# EAGLE design M3 (EAGLE 6.2)
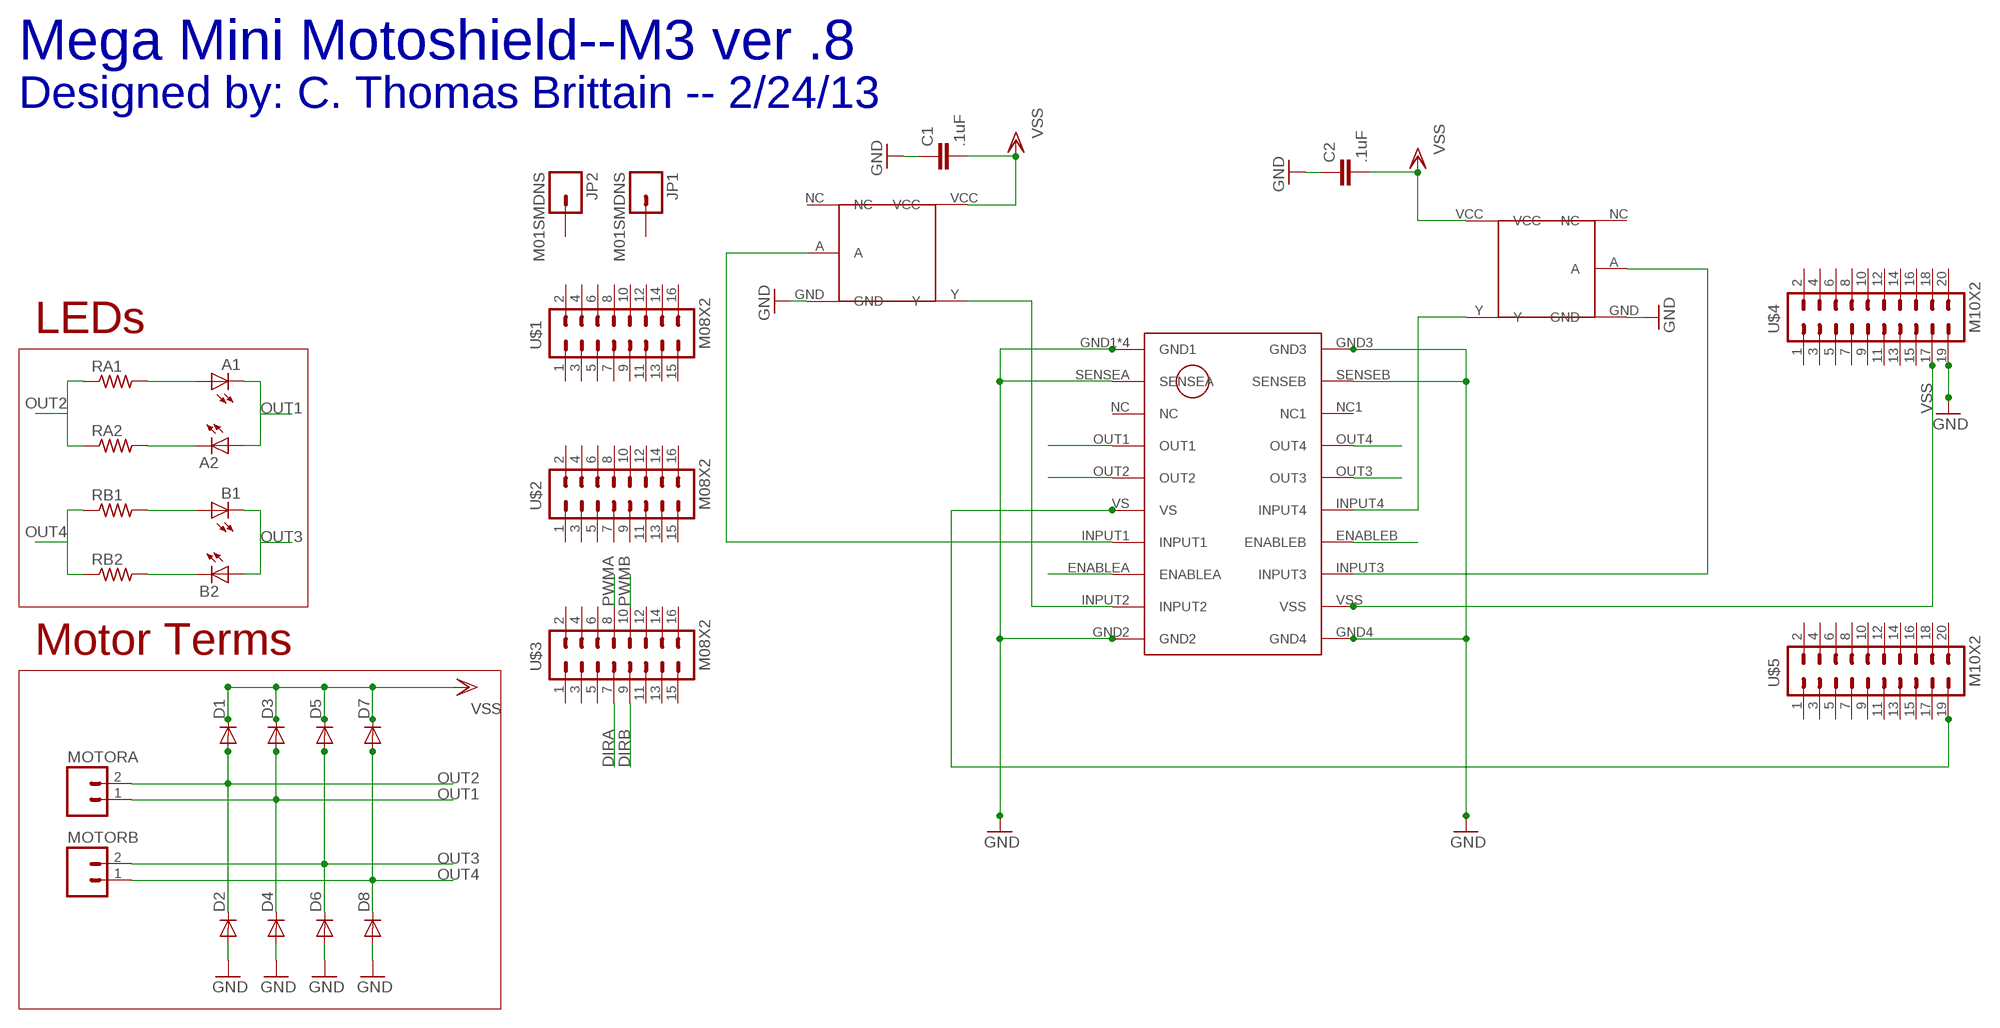
[diagram p0: schematic, sheet 1]

## Parts
A1  LEDSML0603  [SML0603]
A2  LEDSML0603  [SML0603]
B1  LEDSML0603  [SML0603]
B2  LEDSML0603  [SML0603]
C1  .1uF  C-EUC0805  [C0805]
C2  .1uF  C-EUC0805  [C0805]
D1  DIODESMA  [SMA-DIODE]
D2  DIODESMA  [SMA-DIODE]
D3  DIODESMA  [SMA-DIODE]
D4  DIODESMA  [SMA-DIODE]
D5  DIODESMA  [SMA-DIODE]
D6  DIODESMA  [SMA-DIODE]
D7  DIODESMA  [SMA-DIODE]
D8  DIODESMA  [SMA-DIODE]
JP1  M01SMDNS  [1X01NS]
JP2  M01SMDNS  [1X01NS]
MOTORA  M023.5MM  [SCREWTERMINAL-3.5MM-2]
MOTORB  M023.5MM  [SCREWTERMINAL-3.5MM-2]
RA1  R-US_R0805  [R0805]
RA2  R-US_R0805  [R0805]
RB1  R-US_R0805  [R0805]
RB2  R-US_R0805  [R0805]
U$1  M08X2  [2X8]
U$2  M08X2  [2X8]
U$3  M08X2  [2X8]
U$4  M10X2  [2X10]
U$5  M10X2  [2X10]
U$6  L298P  [SMARTPRJ_POWER-SO20]
U$7  74HC1G04  [SPARKFUN_SC70]
U$8  74HC1G04  [SPARKFUN_SC70]

## Nets
DIRA: U$3.7 U$6.INPUT1 U$7.A
DIRB: U$3.9 U$6.INPUT3 U$8.A
GND: C1.1 C2.1 D2.A D4.A D6.A D8.A U$4.19 U$6.GND1 U$6.GND2 U$6.GND3 U$6.GND4 U$6.GND5(GND1) U$6.GND6(GND1) U$6.GND7(GND1) U$6.SENSEA U$6.SENSEB U$7.GND U$8.GND
N$1: A2.C RA2.2
N$2: U$5.19 U$6.VS
N$3: U$6.INPUT2 U$7.Y
N$4: U$6.INPUT4 U$8.Y
N$5: A1.A RA1.2
N$8: B1.A RB1.2
N$11: B2.C RB2.2
OUT1: A1.C A2.A D3.A D4.C MOTORA.1 U$6.OUT1
OUT2: D1.A D2.C MOTORA.2 RA1.1 RA2.1 U$6.OUT2
OUT3: B1.C B2.A D5.A D6.C MOTORB.2 U$6.OUT4
OUT4: D7.A D8.C MOTORB.1 RB1.1 RB2.1 U$6.OUT3
PWMA: U$3.8 U$6.ENABLEA
PWMB: U$3.10 U$6.ENABLEB
VSS: C1.2 C2.2 D1.C D3.C D5.C D7.C U$4.17 U$6.VSS U$7.VCC U$8.VCC
Unconnected: JP1.1 JP2.1 U$1.1 U$1.2 U$1.3 U$1.4 U$1.5 U$1.6 U$1.7 U$1.8 U$1.9 U$1.10 U$1.11 U$1.12 U$1.13 U$1.14 U$1.15 U$1.16 U$2.1 U$2.2 U$2.3 U$2.4 U$2.5 U$2.6 U$2.7 U$2.8 U$2.9 U$2.10 U$2.11 U$2.12 U$2.13 U$2.14 U$2.15 U$2.16 U$3.1 U$3.2 U$3.3 U$3.4 U$3.5 U$3.6 U$3.11 U$3.12 U$3.13 U$3.14 U$3.15 U$3.16 U$4.1 U$4.2 U$4.3 U$4.4 U$4.5 U$4.6 U$4.7 U$4.8 U$4.9 U$4.10 U$4.11 U$4.12 U$4.13 U$4.14 U$4.15 U$4.16 U$4.18 U$4.20 U$5.1 U$5.2 U$5.3 U$5.4 U$5.5 U$5.6 U$5.7 U$5.8 U$5.9 U$5.10 U$5.11 U$5.12 U$5.13 U$5.14 U$5.15 U$5.16 U$5.17 U$5.18 U$5.20 U$6.NC U$6.NC1 U$7.NC U$8.NC

## Notes on the sheet
- Mega Mini Motoshield--M3 ver .8
- Designed by: C. Thomas Brittain -- 2/24/13
- LEDs
- Motor Terms

## Library data of the parts
A1 A2 B1 B2 = led:LED: LED OSRAM: - CHIPLED LG R971, LG N971, LY N971, LG Q971, LY Q971, LO R971, LY R971 LH N974, LH R974 LS Q976, LO Q976, LY Q976 LO Q996 - Hyper CHIPLED LW Q18S LB Q993, LB Q99A, LB R99A - SideLED LS A670, LO A670, LY A670, LG A670, LP A670 LB A673, LV A673, LT A673, LW A673 LH A674 LY A675 LS A676, LA A676, LO A676, LY A676, LW A676 LS A679, LY A679, LG A679 - Hyper Micro SIDELED® LS Y876, LA Y876, LO Y876, LY Y876 LT Y87S - SmartLED LW L88C, LW L88S LB L89C, LB L89S, LG L890 LS L89K, LO L89K, LY L89K LS L896, LA L896, LO L896, LY L896 - TOPLED LS T670, LO T670, LY T670, LG T670, LP T670 LSG T670, LSP T670, LSY T670, LOP T670, LYG T670 LG T671, LOG T671, LSG T671 LB T673, LV T673, LT T673, LW T673 LH T674 LS T676, LA T676, LO T676, LY T676, LB T676, LH T676, LSB T676, LW T676 LB T67C, LV T67C, LT T67C, LS T67K, LO T67K, LY T67K, LW E67C LS E67B, LA E67B, LO E67B, LY E67B, LB E67C, LV E67C, LT E67C LW T67C LS T679, LY T679, LG T679 LS T770, LO T770, LY T770, LG T770, LP T770 LB T773, LV T773, LT T773, LW T773 LH T774 LS E675, LA E675, LY E675, LS T675 LS T776, LA T776, LO T776, LY T776, LB T776 LHGB T686 LT T68C, LB T68C - Hyper Mini TOPLED® LB M676 - Mini TOPLED Santana® LG M470 LS M47K, LO M47K, LY M47K Source: http://www.osram.convergy.de LUXEON: - LUMILED® LXK2-PW12-R00, LXK2-PW12-S00, LXK2-PW14-U00, LXK2-PW14-V00 LXK2-PM12-R00, LXK2-PM12-S00, LXK2-PM14-U00 LXK2-PE12-Q00, LXK2-PE12-R00, LXK2-PE12-S00, LXK2-PE14-T00, LXK2-PE14-U00 LXK2-PB12-K00, LXK2-PB12-L00, LXK2-PB12-M00, LXK2-PB14-N00, LXK2-PB14-P00, LXK2-PB14-Q00 LXK2-PR12-L00, LXK2-PR12-M00, LXK2-PR14-Q00, LXK2-PR14-R00 LXK2-PD12-Q00, LXK2-PD12-R00, LXK2-PD12-S00 LXK2-PH12-R00, LXK2-PH12-S00 LXK2-PL12-P00, LXK2-PL12-Q00, LXK2-PL12-R00 Source: www.luxeon.com KINGBRIGHT: KA-3528ASYC Source: www.kingbright.com
C1 C2 = resistor:C-EU: CAPACITOR, European symbol
D1-D8 = SparkFun:DIODE: Diode These are standard reverse protection diodes and small signal diodes. SMA package can handle up to about 1A. SOD-323 can handle about 200mA. What the SOD-323 package when ordering, there are some mfgs out there that are 5-pin packages.
JP1 JP2 = SparkFun:M01: Header 1 Standard 1-pin 0.1" header. Use with straight break away headers (SKU : PRT-00116), right angle break away headers (PRT-00553), swiss pins (PRT-00743), machine pins (PRT-00117), and female headers (PRT-00115).
MOTORA MOTORB = SparkFun:M02: Header 2 Standard 2-pin 0.1" header. Use with straight break away headers (SKU : PRT-00116), right angle break away headers (PRT-00553), swiss pins (PRT-00743), machine pins (PRT-00117), and female headers (PRT-00115). Molex polarized connector foot print use with SKU : PRT-08233 with associated crimp pins and housings.
RA1 RA2 RB1 RB2 = resistor:R-US_: RESISTOR, American symbol
U$1-U$3 = SparkFun:M08X2
U$4 U$5 = SparkFun:M10X2: This was SPECIALLY designed to be used with our Graphic LCD Backpack. Be sure you want to use this! It is not only staggered on each line of header holes, but IT IS ALSO offset of the center point of the top and bottom lines by 5 mil. This causes the headers to lock into place on the "standard" footprint on the LCD screen. The extra squares on the tdocu layer are there simply to reference other pins (if you were to actually populate a longer header than ten long - this is what we do with the backpacks).
U$6 = Shield_Motor-REV3c:L298P
U$7 U$8 = Ardumoto_v13:74HC1G04

## Board
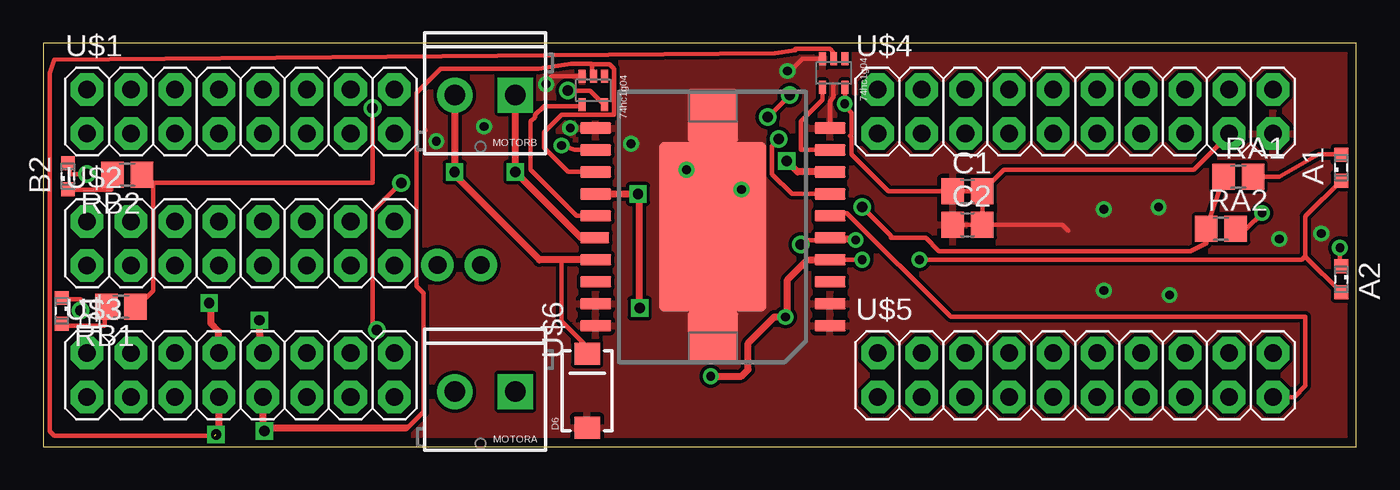
[diagram p1: board, top side]
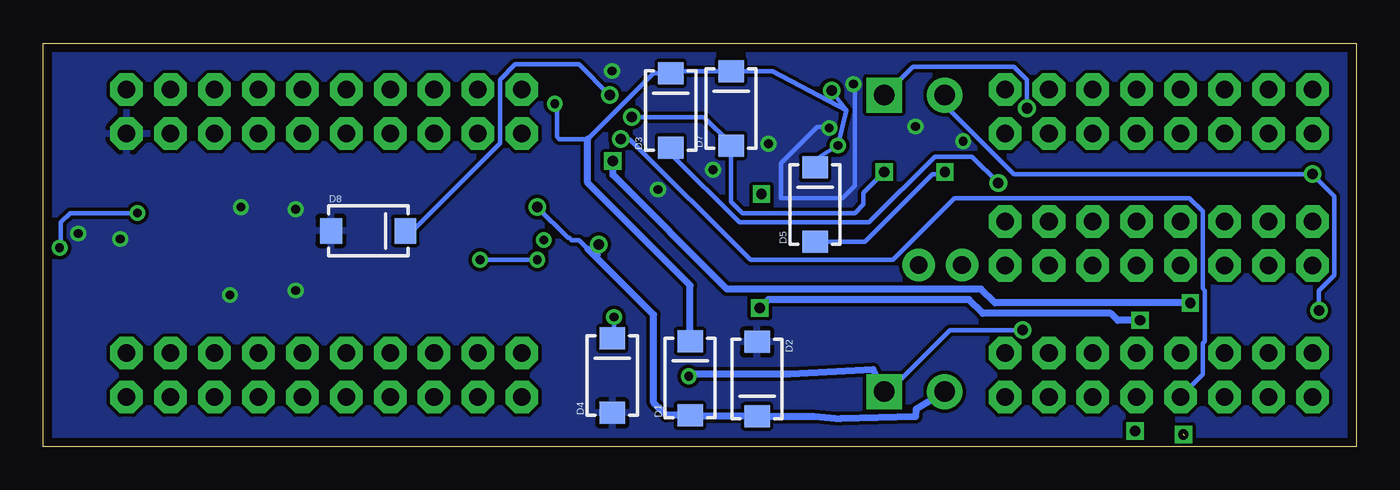
[diagram p2: board, bottom side, seen from below]

Size 75.95 x 23.32 mm. Coordinates in mm from the lower left corner, seen from the top.
Outline: 0,0 75.95,0 75.95,23.32 0,23.32 0,0
Copper layers (1*16): Top 0.035mm / dielectric 1.5mm / Bottom 0.035mm
Design rules: minimum track width 10mil, minimum drill 24mil, track to track 8mil, track to pad 8mil, pad to pad 8mil, via to via 8mil, smd to smd 8mil, copper to edge 20mil, drill to drill 8mil, minimum pad ring 10mil, minimum via ring 8mil, stop-mask expansion 4mil, vias tented up to drill 0mil, thermal gap 10mil

### Footprints (pad centres in the part's own frame; a part is rotated, then mirrored left to right if it is on the bottom)
SML0603 = smd 0.8 x 0.8: A 0.75,0; C -0.75,0
C0805 = smd 1.3 x 1.5: 1 -0.85,0; 2 0.85,0
SMA-DIODE = smd 1.27 x 1.47: A -2.15,0; C 2.15,0
1X01NS = drill 1.016 pad 1.88: 1 0,0
SCREWTERMINAL-3.5MM-2 = drill 1.2 pad 2.032 square: 1 0,0 | drill 1.2 pad 2.032: 2 3.5,0
R0805 = smd 1.3 x 1.5: 1 -0.85,0; 2 0.85,0
2X8 = drill 1.016 pad 1.88 octagon: 1 0,0; 2 0,2.54; 3 2.54,0; 4 2.54,2.54; 5 5.08,0; 6 5.08,2.54; 7 7.62,0; 8 7.62,2.54; 9 10.16,0; 10 10.16,2.54; 11 12.7,0; 12 12.7,2.54; 13 15.24,0; 14 15.24,2.54; 15 17.78,0; 16 17.78,2.54
2X10 = drill 1.016 pad 1.88 octagon: 1 -11.43,-1.27; 2 -11.43,1.27; 3 -8.89,-1.27; 4 -8.89,1.27; 5 -6.35,-1.27; 6 -6.35,1.27; 7 -3.81,-1.27; 8 -3.81,1.27; 9 -1.27,-1.27; 10 -1.27,1.27; 11 1.27,-1.27; 12 1.27,1.27; 13 3.81,-1.27; 14 3.81,1.27; 15 6.35,-1.27; 16 6.35,1.27; 17 8.89,-1.27; 18 8.89,1.27; 19 11.43,-1.27; 20 11.43,1.27
SMARTPRJ_POWER-SO20 = smd 1.778 x 0.635: ENABLEA -8.052,-4.445; ENABLEB 5.512,-3.175; GND1 -8.052,4.445; GND2 -8.052,-6.985; GND3 5.512,4.445; GND4 5.512,-6.985; INPUT1 -8.052,-3.175; INPUT2 -8.052,-5.715; INPUT3 5.512,-4.445; INPUT4 5.512,-1.905; NC -8.052,1.905; NC1 5.512,1.905; OUT1 -8.052,0.635; OUT2 -8.052,-0.635; OUT4 5.512,0.635; SENSEA -8.052,3.175; SENSEB 5.512,3.175; VS -8.052,-1.905; VSS 5.512,-5.715 | smd 2.921 x 3.048: GND5 -1.27,5.156; GND6 -1.27,-7.696 | smd 6.198 x 9.804: GND7 -1.27,-1.27 | smd 1.651 x 0.635: OUT3 5.563,-0.635
SPARKFUN_SC70 = smd 0.75 x 0.4: A -0.825,0; GND -0.825,-0.65; NC -0.825,0.65; VCC 0.825,0.65; Y 0.825,-0.65

### Placement (x,y rotation side)
A1  75.07,16.12 90 top
A2  75.07,9.66 270 top
B1  1.07,7.84 270 top
B2  1.43,15.62 90 top
C1  53.46,14.75 0 top
C2  53.46,12.83 0 top
D1  38.53,3.95 90 bottom
D2  34.66,3.9 270 bottom
D3  39.65,19.43 90 bottom
D4  43.03,4.1 90 bottom
D5  31.3,13.99 90 bottom
D6  31.46,3.22 90 top
D7  36.16,19.55 90 bottom
D8  57.15,12.47 0 bottom
JP1  22.81,10.49 0 top
JP2  25.3,10.49 0 top
MOTORA  27.3,3.17 180 top
MOTORB  27.3,20.32 180 top
RA1  69.12,15.61 0 top
RA2  68.12,12.59 0 top
RB1  4.49,8.07 180 top
RB2  4.87,15.72 180 top
U$1  2.54,18.1 0 top
U$2  2.54,10.48 0 top
U$3  2.54,2.86 0 top
U$4  59.69,19.37 0 top
U$5  59.69,4.13 0 top
U$6  37.47,11.43 180 top
U$7  45.72,21.59 270 top
U$8  31.82,20.58 270 top

### Tracks (layer width: path | path; a pad name or v marks a point on that pad's centre or on a via)
DIRA  (via drill 0.6, 0.61)  (1 unrouted)
  Top 0.254: 9.91,0.64 0.64,0.64 0.38,0.89 0.38,21.59 0.64,22.35 42.32,22.73 43.5,22.9 43.5,23 45.5,23 45.72,22.78 U$7.A | U$6.INPUT1 43.31,14.61 42.16,15.75 42.16,17.4 v42.55,17.78
  Top 0.406: U$3.7 10.16,0.86 v10,0.7
  Bottom 0.254: v42.55,17.78 42.04,17.78 35.05,10.79 26.8,10.79 23.24,14.35 9.65,14.35 8.89,13.59 8.89,9.14 8.76,9.02 8.76,6.1 8.89,5.97 8.89,4.19 10.16,2.92 U$3.7
DIRB  (via drill 0.6)
  Top 0.254: 13,1 21,1 21.11,1.11 | 21.11,1.11 22,2 22,8.86 21.59,9.27 21.59,20.45 22.99,21.84 28.66,21.84 30.52,22.14 31.7,22.14 31.75,22.1 | 31.75,22.1 31.75,21.48 U$8.A | U$6.INPUT3 30.35,15.88 28.96,17.27 28.96,18.16 29.97,19.18 33.02,19.18 33.02,21.84 32.77,22.1 31.75,22.1 | v12.8,0.9 12.83,1.14 21.08,1.14 21.11,1.11
  Top 0.406: U$3.9 12.7,1 v12.8,0.9
GND  (via drill 0.51)
  Top 0.254: 22.1,18.29 22.12,18.29 | U$8.GND 29.41,21.41 29,21 | C2.1 58.94,12.83 D8.A | 45.59,18.41 U$6.GND2 45.59,18.41 | U$7.GND 43.91,22.41 43,21.5 | 45.72,20.95 45.72,20.19 45.5,19.97 45.5,18.5 45.59,18.41
  Bottom 0.254: 29,21 29,15.07 29.72,14.35 33.27,14.35 33.27,16.38 31.16,18.5 30.5,18.5
  other vias: 73.91,12.32 71.5,12 22.73,17.65 25.5,18.5 29.08,20.95 30.48,18.41 61.34,13.72 64.52,13.84 61.34,9.02 65.15,8.76 34,17.5 43.05,21.72 37.21,16 40.39,14.86
  pour Top: 0,22.86 0,0 76.2,0 76.2,23.5 0,23.5
  pour Bottom: 76.2,0 76.2,23.5 0,23.5 0,22.86 0,0
N$1  (via drill 0.51)
  Top 0.254: RA2.2 69.59,12.59 v70.5,13.5 | v75,11.5 75,10.48 A2.C
  Bottom 0.254: v70.5,13.5 74.38,13.5 74.93,12.95 74.93,11.57 v75,11.5
N$2
  Top 0.254: U$5.19 72.36,2.86 73,3.5 73,7.5 52.5,7.5 46.5,13.5 46,13.5 45.84,13.34 U$6.VS
N$3
  Top 0.254: U$7.Y 45.07,20.05 43.81,18.8 43.81,17.14 U$6.INPUT2
N$4
  Top 0.254: U$6.INPUT4 30.86,13.34 28.19,16 28.19,18.8 28.45,19.05 28.45,19.18 28.96,19.68 31.1,19.68 U$8.Y
N$5
  Top 0.254: RA1.2 71.5,15.61 73.79,16.89 75.05,16.89 A1.A
N$6  (via drill 0.51)
  other vias: 46.99,11.94
N$8
  Top 0.254: B1.A 1.14,6.99 3.56,6.99 3.56,8 RB1.2
N$11
  Top 0.254: B2.C 1.52,14.86 3.94,14.86 3.94,15.62 RB2.2
OUT1  (via drill 0.51, 0.61)
  Top 0.254: v47.37,10.79 U$6.OUT1 | v50.67,10.79 72.8,10.79 73,11 | 73,11 73,10.98 A2.A | 73,11 73,13.3 A1.C | v20.7,15.24 19.05,13.59 19.05,6.99 v19.3,6.73
  Top 0.406: v38.61,4.06 40.39,4.06 40.77,4.45 40.77,5.97 42.29,7.49 v42.93,7.49 43.05,7.49 43.05,9.65 44.2,10.79 U$6.OUT1
  Bottom 0.254: v47.37,10.79 v50.67,10.79 | v42.93,7.49 42.93,6.35 D4.C | v20.7,15.24 22.23,16.76 24.38,16.76 28.19,12.95 35.69,12.95 39.62,16.89 39.62,17.27 D3.A | v19.3,6.73 23.5,6.73 27.18,3.05 MOTORA.1
  Bottom 0.406: MOTORA.1 27.94,4.45 32.77,4.19 38.48,4.19 v38.61,4.06
OUT2  (via drill 0.61)
  Top 0.254: RA1.1 RA2.1 67.27,11.74 66.33,11.3 51.82,11.3 51.05,12.06 49.02,12.06 49.02,12.19 v47.37,13.84 | U$6.OUT2 46.86,12.06 46.99,11.94 45.64,11.94 U$6.OUT2 | v43.81,11.68 44.07,11.94 45.47,11.94 U$6.OUT2
  Bottom 0.254: 44.45,11.43 44.96,11.94 45.39,11.94 U$6.OUT2 45.59,12.06 v47.37,13.84 | v43.81,11.68 43.81,11.05 43.94,10.92
  Bottom 0.406: MOTORA.2 25.46,2.16 25.5,1.74 29.81,1.61 31.35,1.75 D2.C 38.48,1.75 D1.A 39.9,1.8 40.64,2.54 40.64,7.62 43.94,10.92 44.45,11.43
OUT3  (via drill 0.6, 0.61)
  Top 0.254: 29.97,10.79 29.97,7.24 31.24,5.97 31.24,5.59 31.75,5.59 D6.C | v2.16,7.87 2.16,8.51 1.14,8.51 B1.C | v2.54,15.75 1.52,15.75 1.52,16.26 B2.A
  Top 0.406: MOTORB.2 23.8,16.18 v23.8,15.88 23.8,15.71 28.7,10.79 29.97,10.79 U$6.OUT4
  Bottom 0.254: D5.A 28.42,11.84 24.51,15.75 23.92,15.75 v23.8,15.88 | v2.16,7.87 2.16,9.02 1.27,9.91 1.27,14.48 v2.54,15.75 19.81,15.75 23.75,19.68 23.75,20.32 MOTORB.2
OUT4  (via drill 0.6, 0.61)
  Top 0.254: RB1.1 5.46,8.13 6.35,9.02 6.35,15.11 5.84,15.62 RB2.1 6.35,15.24 19.05,15.24 v19.05,19.56 | v41.91,19.05 v43.18,20.32
  Top 0.406: MOTORB.1 v27.3,15.88 31.11,12.06 U$6.OUT3
  Bottom 0.254: v27.3,15.88 28.5,14.68 28.5,14 29,13.5 35.5,13.5 36.16,14.16 D7.A 36.2,17.53 37.72,19.05 v41.91,19.05 | v43.18,20.32 44.96,22.1 48.64,22.1 49.53,21.21 49.53,17.53 54.48,12.57 54.99,12.57 D8.C | v19.05,19.56 19.05,21.21 19.81,21.97 25.65,21.97 MOTORB.1
PWMA  (via drill 0.6)
  Top 0.406: U$3.8 10.16,6.64 9.7,7.1 9.7,8.2 v9.6,8.3 | U$6.ENABLEA 43.62,15.88 v43,16.5
  Bottom 0.406: v9.6,8.3 20.9,8.3 21.7,9.1 36.4,9.1 43,15.7 v43,16.5
PWMB  (via drill 0.6)
  Top 0.406: v12.5,7.3 12.5,6.6 U$3.10 | U$6.ENABLEB v34.4,14.6 34.5,14.5 v34.5,8
  Bottom 0.406: v12.5,7.3 13.8,7.3 14.2,7.7 21.6,7.7 22.4,8.5 34,8.5 v34.5,8
VSS  (via drill 0.51, 0.61)
  Top 0.254: U$7.VCC 46.38,19.83 v46.35,19.81 46.35,19.68 46.74,19.3 46.74,18.03 46.67,17.97 46.74,17.91 46.74,16.89 48.88,14.75 C1.2 | U$6.VSS 30.73,17.14 v29.97,17.41 | U$4.17 68.58,18.03 66.55,16 55.56,16 C1.2 | C1.2 C2.2 | v30.35,20.57 31.62,20.57 32.38,19.81 U$8.VCC
  Bottom 0.254: v46.35,19.81 46.23,19.56 46.23,17.91 46.1,17.78 44.45,17.78 40.65,21.59 D3.C 39.53,21.7 D7.C 33.77,21.7 29.5,19.43 | 29.5,19.43 v29.97,17.41 31.3,16.58 D5.C | 29.5,19.43 v30.35,20.57
  Bottom 0.406: D1.C 38.53,9.32 44.45,15.24 44.45,17.78